# EAGLE design m1seminar (EAGLE 9.6.2)
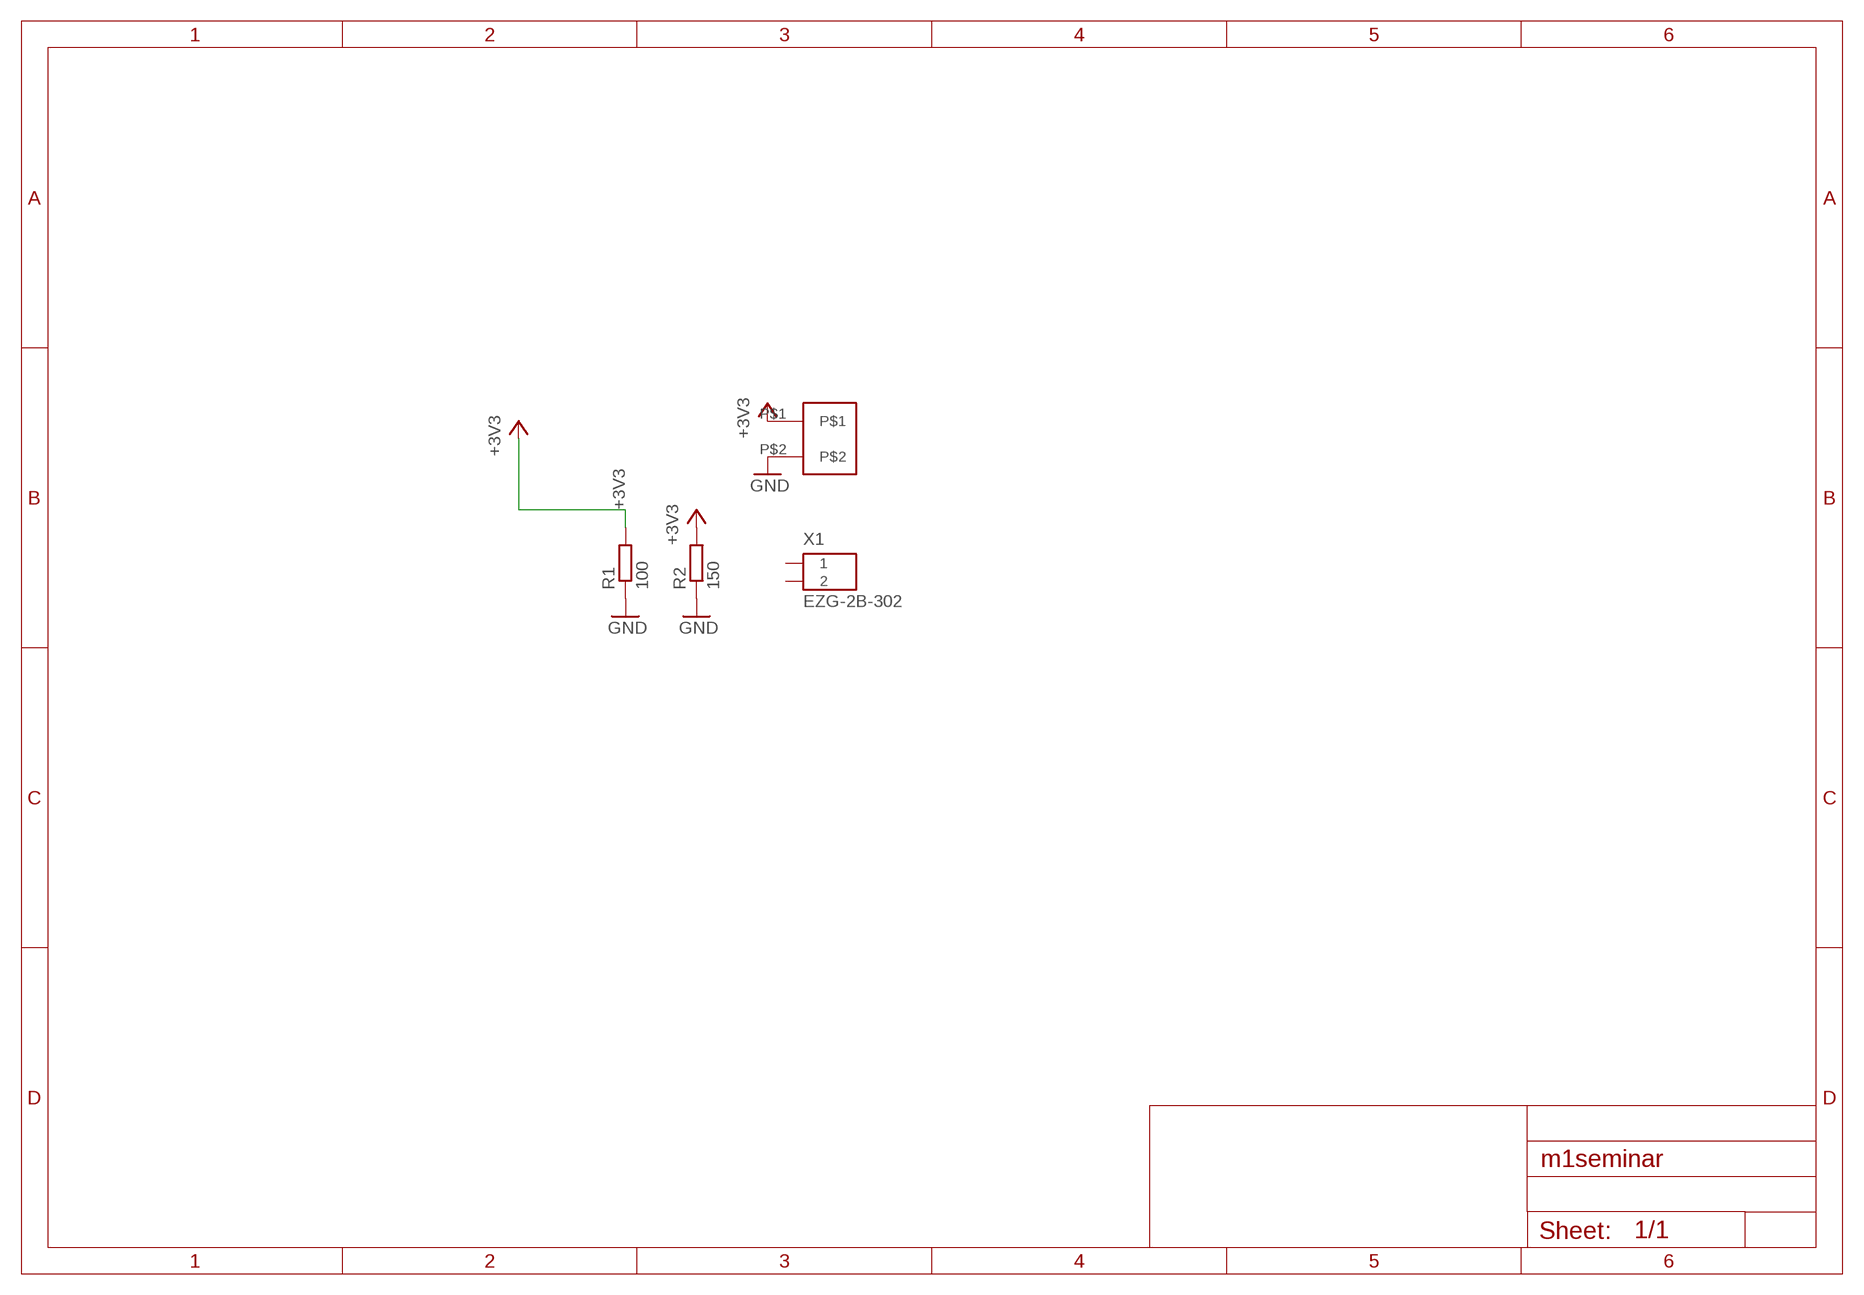
[diagram p0: schematic, sheet 1]

## Parts
R1  100  R-EU_0204/7  [0204/7]
R2  150  R-EU_0204/7  [0204/7]
U$1  DF1E-2P  [DF1E-2P]
X1  EZG-2B-302  [EZG-2B-2K-302]

## Nets
+3V3: R1.2 R2.2 U$1.P$1
GND: R1.1 R2.1 U$1.P$2
Unconnected: X1.1 X1.2

## Library data of the parts
R1 R2 = rcl:R-EU_: RESISTOR, European symbol; SPICEPREFIX: R
U$1 = m1seminar:DF1E-2P
X1 = con-lemo:EZG-?-302: LEMO Connector Source: http://www.lemo.com/pdfs/catalog/ROW/German/unipole_multipole.pdf; OC_FARNELL: unknown; OC_NEWARK: unknown

## Board
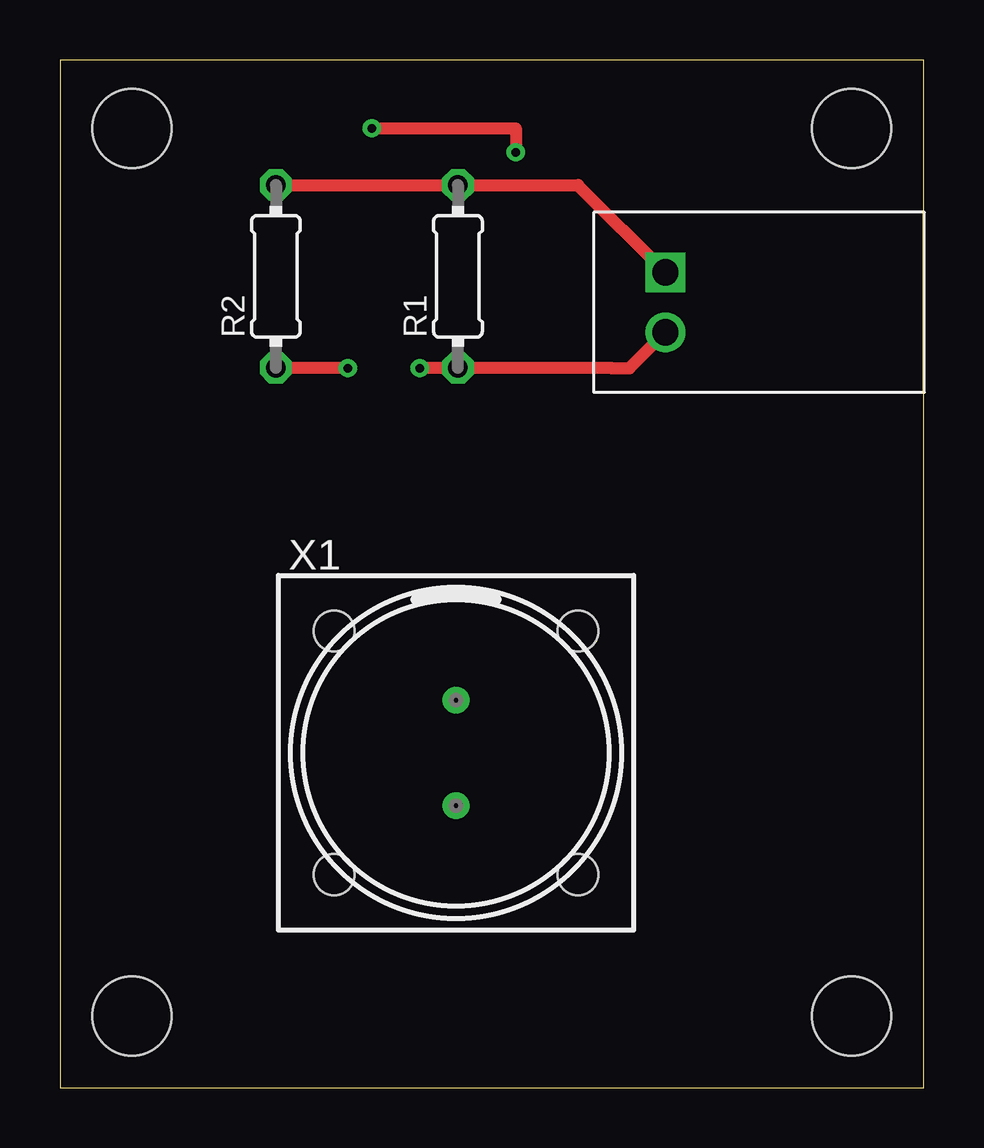
[diagram p1: board, top side]
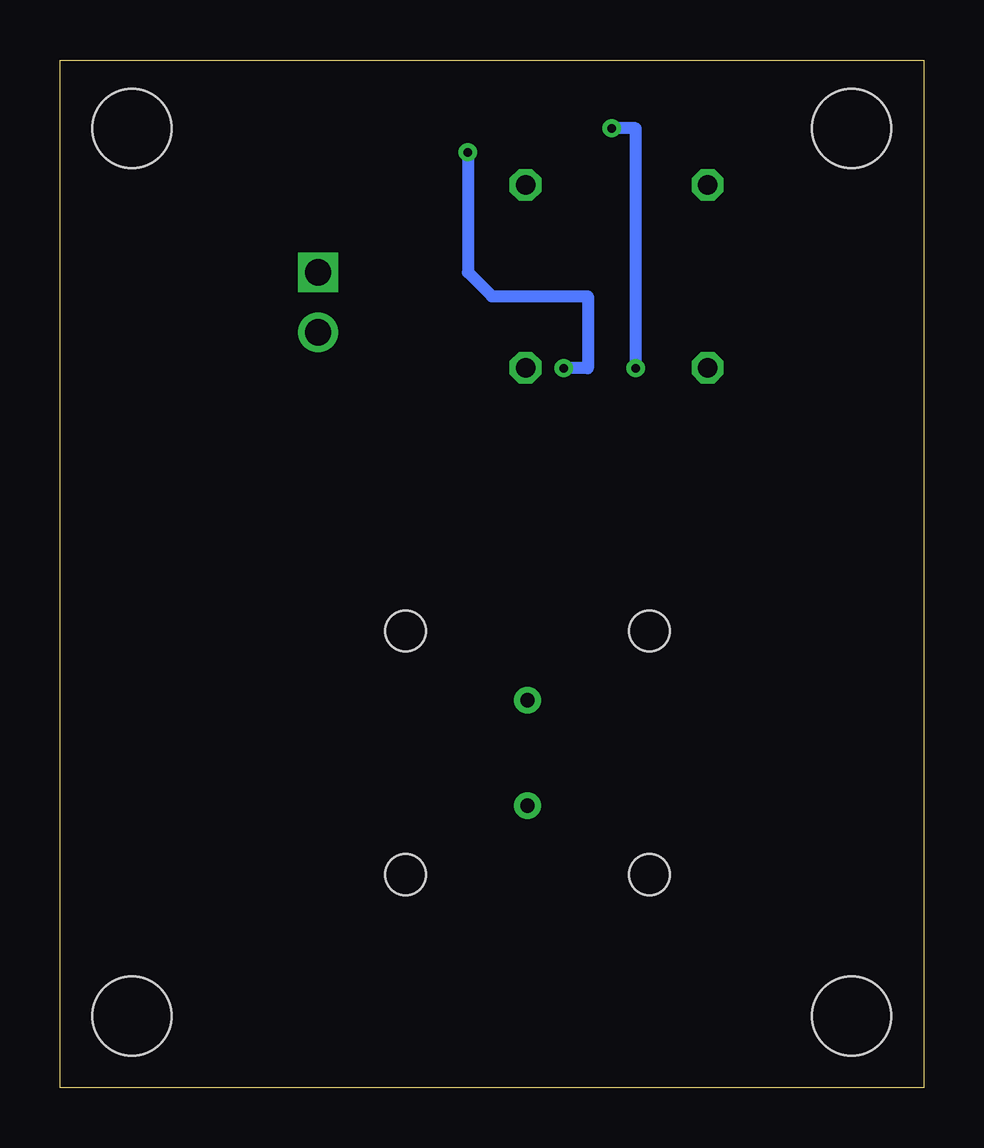
[diagram p2: board, bottom side, seen from below]

Size 36 x 42.85 mm. Coordinates in mm from the lower left corner, seen from the top.
Outline: 0,0 36,0 36,42.85 0,42.85 0,0
Copper layers (1*16): Top 0.035mm / dielectric 1.5mm / Bottom 0.035mm
Design rules "default": minimum track width 6mil, minimum drill 0.35mm, track to track 6mil, track to pad 6mil, pad to pad 6mil, via to via 6mil, smd to smd 6mil, copper to edge 40mil, drill to drill 6mil, minimum pad ring 10mil, minimum via ring 8mil, stop-mask expansion 4mil, vias tented up to drill 0mil, thermal gap 10mil
Holes 3.3 mm at 3,40 33,40 3,3 33,3

### Footprints (pad centres in the part's own frame; a part is rotated, then mirrored left to right if it is on the bottom)
0204/7 = drill 0.813 octagon: 1 -3.81,0; 2 3.81,0
DF1E-2P = drill 1.1 square: P$1 0,1.25 | drill 1.1: P$2 0,-1.25
EZG-2B-2K-302 = drill 0.6 pad 1: 1 0,2.2; 2 0,-2.2 | hole 1.7: -5.08,5.08; 5.08,5.08; 5.08,-5.08; -5.08,-5.08

### Placement (x,y rotation side)
R1  16.59,33.83 90 top
R2  9,33.83 90 top
U$1  25.24,32.75 0 top
X1  16.51,13.97 0 top

### Tracks (layer width: path | path; a pad name or v marks a point on that pad's centre or on a via)
+3V3
  Top 0.508: R2.2 R1.2 21.6,37.64 U$1.P$1
GND  (via drill 0.35)
  Top 0.508: R2.1 11.98,30.02 v12,30 | v13,40 19,40 v19,39 | v15,30 15.02,30.02 R1.1 22.98,30.02 23,30 23.74,30 U$1.P$2
  Bottom 0.508: v12,30 12,40 v13,40 | v19,39 19,34 18,33 14,33 14,30 v15,30